# Altium schematic sheet System Control - Serial Port.SchDoc
size B; PageSetup: Record=PageOptions|CenterHorizontal=True|CenterVertical=True|PrintScale=1.09|XCorrection=1.00|YCorrection=1.00|PrintKind=1|BorderSize=5000000|LeftOffset=0|BottomOffset=0|Orientation=2|PaperLength=1000|PaperWidth=1000|Scale=100|PaperSource=261|PrintQuality=600|MediaType=1|DitherType=10|PaperKind=11x17|PrintScaleMode=1
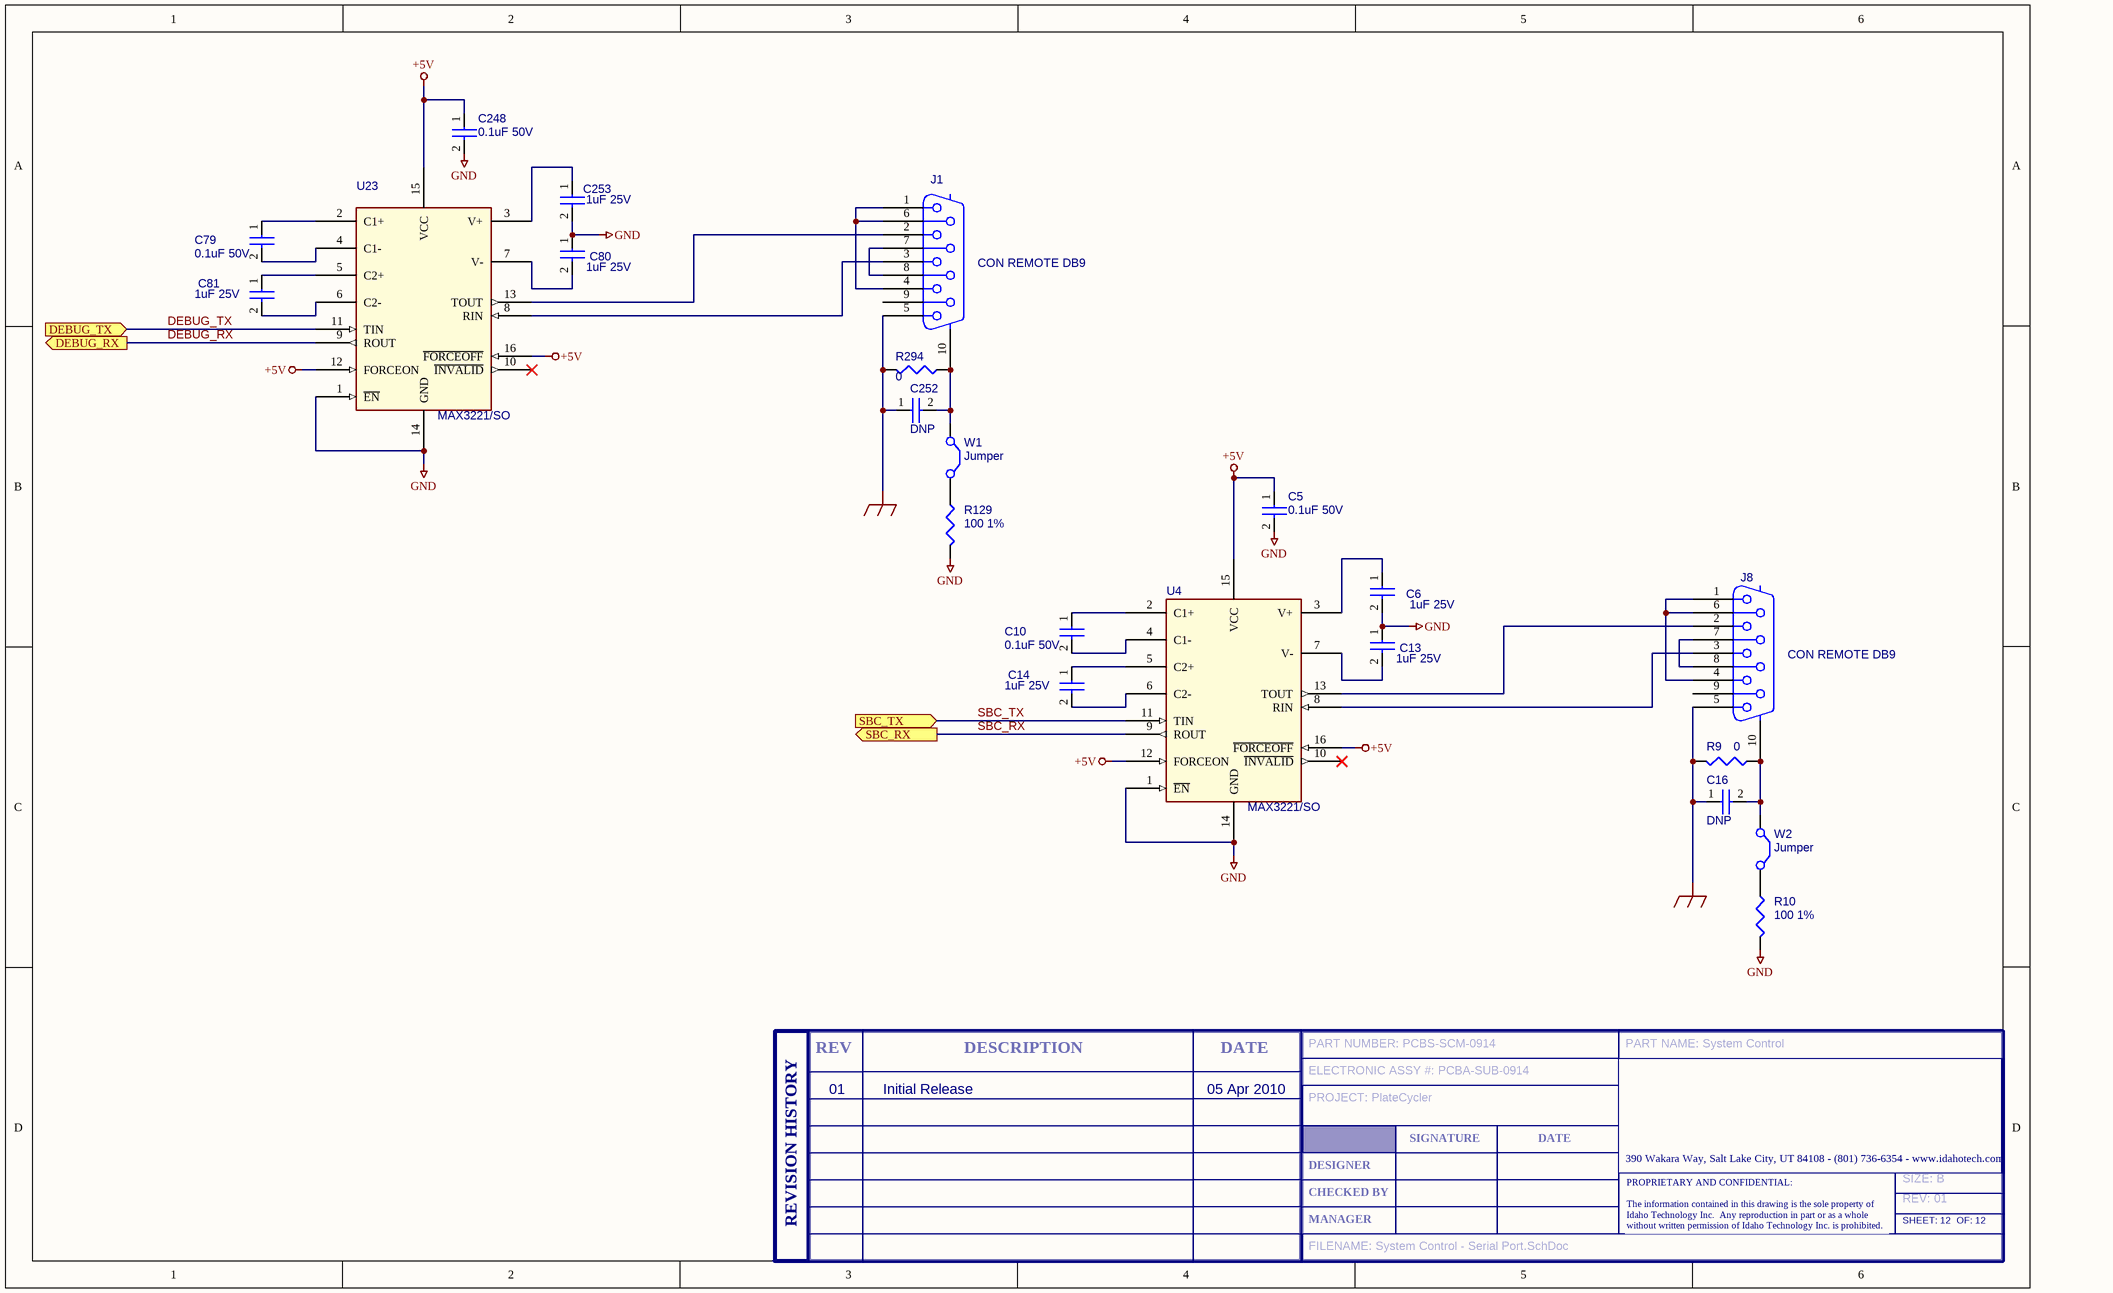
[diagram p0: System Control - Serial Port.SchDoc]

## Parts
C5  0.1uF 50V  [SM/C_0603]
C6  1uF 25V  [SM/C_0603]
C10  0.1uF 50V  [SM/C_0603]
C13  1uF 25V  [SM/C_0603]
C14  1uF 25V  [SM/C_0603]
C16  DNP  [SM/C_0603]  (no BOM)
C79  0.1uF 50V  [SM/C_0603]
C80  1uF 25V  [SM/C_0603]
C81  1uF 25V  [SM/C_0603]
C248  0.1uF 50V  [SM/C_0603]
C252  DNP  [SM/C_0603]  (no BOM)
C253  1uF 25V  [SM/C_0603]
J1  CON REMOTE DB9  [RS232 HEADER]
J8  CON REMOTE DB9  [RS232 HEADER]
R9  0  [SM/R_0603]
R10  100 1%  [0805]
R129  100 1%  [SM/R_0805]
R294  0  [SM/R_0603]
T?  SIZE: B  REV: 01  FILENAME: System Control - Serial Port.SchDoc  PART NUMBER: PCBS-SCM-0914  PART NAME: System Control  ELECTRONIC ASSY #: PCBA-SUB-0914  PROJECT: PlateCycler  SHEET: 12  (hidden comment: ITI Title Block, A Size)  (graphical)
U4  MAX3221/SO  [16TSSOP]
U23  MAX3221/SO  [SOG.65M/16/WG8.20/L6.35]
W1  Jumper  [HDR1X2]
W2  Jumper  [HDR1X2]

## Ports
DEBUG_RX (out), DEBUG_TX (in), SBC_RX (out), SBC_TX (in)

## Nets
+5V: C5.1 C248.1 U4.12(FORCEON) U4.15(VCC) U4.16(~{FORCEOFF}) U23.12(FORCEON) U23.15(VCC) U23.16(~{FORCEOFF})
EGND: C16.1 C252.1 J1.5 J8.5 R9.2 R294.2
GND: C5.2 C6.2 C13.1 C80.1 C248.2 C253.2 R10.2 R129.2 U4.1(~{EN}) U4.14(GND) U23.1(~{EN}) U23.14(GND)
DEBUG_RX: U23.9(ROUT) ; port DEBUG_RX
DEBUG_TX: U23.11(TIN) ; port DEBUG_TX
SBC_RX: U4.9(ROUT) ; port SBC_RX
SBC_TX: U4.11(TIN) ; port SBC_TX
NetC6_1: C6.1 U4.3(V+)
NetC10_1: C10.1 U4.2(C1+)
NetC10_2: C10.2 U4.4(C1-)
NetC13_2: C13.2 U4.7(V-)
NetC14_1: C14.1 U4.5(C2+)
NetC14_2: C14.2 U4.6(C2-)
NetC16_2: C16.2 J8.10 R9.1 W2.1(C1)
NetC79_1: C79.1 U23.2(C1+)
NetC79_2: C79.2 U23.4(C1-)
NetC80_2: C80.2 U23.7(V-)
NetC81_1: C81.1 U23.5(C2+)
NetC81_2: C81.2 U23.6(C2-)
NetC252_2: C252.2 J1.10 R294.1 W1.1(C1)
NetC253_1: C253.1 U23.3(V+)
NetJ1_1: J1.1 J1.4 J1.6
NetJ1_2: J1.2 U23.13(TOUT)
NetJ1_3: J1.3 U23.8(RIN)
NetJ1_7: J1.7 J1.8
NetJ8_1: J8.1 J8.4 J8.6
NetJ8_2: J8.2 U4.13(TOUT)
NetJ8_3: J8.3 U4.8(RIN)
NetJ8_7: J8.7 J8.8
NetR10_1: R10.1 W2.2(C2)
NetR129_1: R129.1 W1.2(C2)

Not connected (* = marked no-connect by the designer): J1 9; J8 9; U4 10(~{INVALID})*; U23 10(~{INVALID})*

## Notes on the sheet
- 01
- Initial Release
- 05 Apr 2010
- (in symbol ITI A-size Title Block and Rev Table) REV; DESCRIPTION; DATE; SIGNATURE; 390 Wakara Way, Salt Lake City, UT 84108 - (801) 736-6354 - www.idahotech.com; DESIGNER; CHECKED BY; REVISION HISTORY; MANAGER; PROPRIETARY AND CONFIDENTIAL: / The information contained in this drawing is the sole property of / Idaho Technology Inc.  Any reproduction in part or as a whole / without written permission of Idaho Technology Inc. is prohibited.

## Library data of the parts
C5 C10 C16 C79 C248 C252 = CAP NP_1: CAP CER .10UF 50V X7R 0603; Manufacturer P/N: UMK107B7104KA-T; Manufacturer: Taiyo Yuden; Vendor P/N: 587-1243-1-ND; Vendor: Digikey
C6 C13 C14 C80 C81 C253 = CAP NP_1: CAP 1UF 25V CERAMIC 0603 X5S; Manufacturer P/N: ECJ-1V41E105M; Manufacturer: Panasonic; Vendor P/N: PCC2354CT-ND; Vendor: Digikey
J1 J8 = CONNECTOR DB9_1: CONN HEADER 10 POS STRGHT GOLD; Manufacturer: 3M/ESD; Manufacturer P/N: N2510-6002RB; Vendor: Digikey; Vendor P/N: MHC10K-ND
R9 R294 = R0 5% 0603: RES ZERO OHM 1/10W 5% 0603 SMD; Manufacturer: Panasonic; Manufacturer P/N: ERJ-3GEY0R00V; Vendor: Digikey; Vendor P/N: P0.0GCT-ND
R10 R129 = R: RES 100 OHM 1/10W 1% 0805 SMD; Manufacturer: Panasonic; Manufacturer P/N: ERJ-6ENF1000V; Vendor: Digikey; Vendor P/N: P100CCT-ND
T? = ITI A-size Title Block and Rev Table: ITI Title Block and Rev Table, A Size; OF: 12
U4 U23 = MAX3221/SO_0: IC DRVR/RCVR RS-232 1-CH 16TSSOP; Manufacturer: Maxim; Manufacturer P/N: MAX3221CPWR; Vendor: Digikey; Vendor P/N: 296-9594-1-ND
W1 W2 = Jumper: CONN HEADER 2POS .100" STR TIN; Manufacturer: Molex; Manufacturer P/N: 90120-0122; Vendor: Digikey; Vendor P/N: WM8072-ND; Published: 24-Mar-1999; LatestRevisionDate: 17-Jul-2002; LatestRevisionNote: Re-released for DXP Platform.; PackageReference: RAD-0.2; Publisher: Altium Limited